# Altium project BTF16.PrjPcb
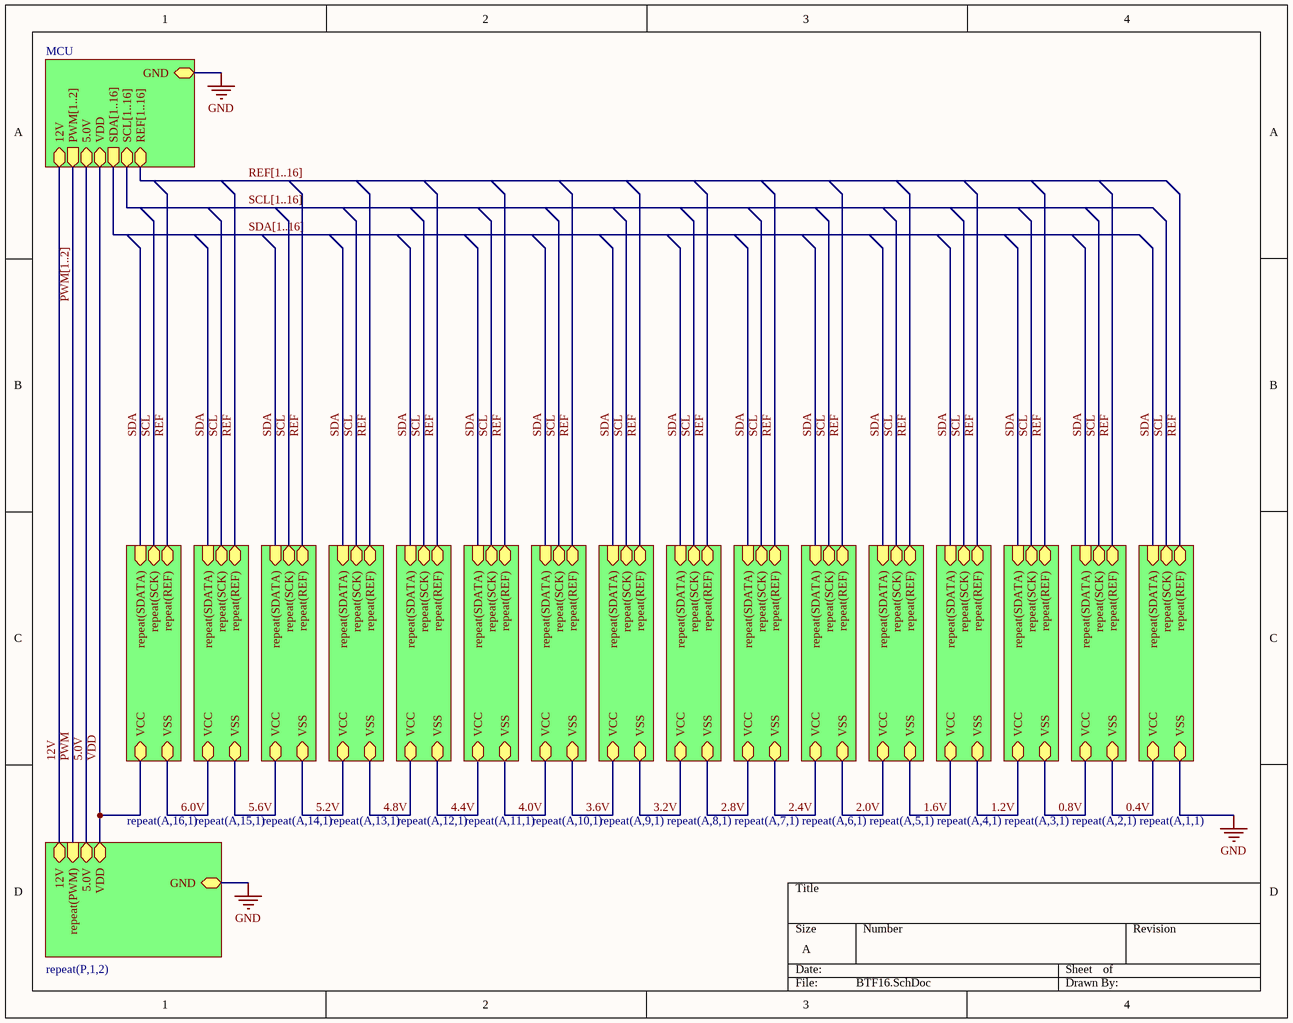
[diagram p0: BTF16.SchDoc]
4 sheets, 80 parts. Net scope: strictly hierarchical (ports join the sheet entries above them; power ports are local).
Board file: BTF16.PcbDoc
Sheets:
  BTF16.SchDoc
    MCU = MCU.SchDoc
    P1 = POWER.SchDoc
    P2 = POWER.SchDoc
    A1 = ASIC.SchDoc

## Sheet BTF16.SchDoc
size A

### Sub-sheets
MCU = MCU.SchDoc: VDD, GND, SDA[1..16] (out), SCL[1..16], 12V, REF[1..16], 5.0V, PWM[1..2] (out)
repeat(A,1,1) = ASIC.SchDoc: VCC, VSS, repeat(SDATA) (in), repeat(SCK), repeat(REF)
repeat(A,2,1) = ASIC.SchDoc: VCC, VSS, repeat(SDATA) (in), repeat(SCK), repeat(REF)
repeat(A,3,1) = ASIC.SchDoc: VCC, VSS, repeat(SDATA) (in), repeat(SCK), repeat(REF)
repeat(A,4,1) = ASIC.SchDoc: VCC, VSS, repeat(SDATA) (in), repeat(SCK), repeat(REF)
repeat(A,5,1) = ASIC.SchDoc: VCC, VSS, repeat(SDATA) (in), repeat(SCK), repeat(REF)
repeat(A,6,1) = ASIC.SchDoc: VCC, VSS, repeat(SDATA) (in), repeat(SCK), repeat(REF)
repeat(A,7,1) = ASIC.SchDoc: VCC, VSS, repeat(SDATA) (in), repeat(SCK), repeat(REF)
repeat(A,8,1) = ASIC.SchDoc: VCC, VSS, repeat(SDATA) (in), repeat(SCK), repeat(REF)
repeat(A,9,1) = ASIC.SchDoc: VCC, VSS, repeat(SDATA) (in), repeat(SCK), repeat(REF)
repeat(A,10,1) = ASIC.SchDoc: VCC, VSS, repeat(SDATA) (in), repeat(SCK), repeat(REF)
repeat(A,11,1) = ASIC.SchDoc: VCC, VSS, repeat(SDATA) (in), repeat(SCK), repeat(REF)
repeat(A,12,1) = ASIC.SchDoc: VCC, VSS, repeat(SDATA) (in), repeat(SCK), repeat(REF)
repeat(A,13,1) = ASIC.SchDoc: VCC, VSS, repeat(SDATA) (in), repeat(SCK), repeat(REF)
repeat(A,14,1) = ASIC.SchDoc: VCC, VSS, repeat(SDATA) (in), repeat(SCK), repeat(REF)
repeat(A,15,1) = ASIC.SchDoc: VCC, VSS, repeat(SDATA) (in), repeat(SCK), repeat(REF)
repeat(A,16,1) = ASIC.SchDoc: VCC, VSS, repeat(SDATA) (in), repeat(SCK), repeat(REF)
repeat(P,1,2) = POWER.SchDoc: GND, VDD, 12V, 5.0V, repeat(PWM) (in)

### Nets
GND: sheet MCU/GND, sheet repeat(P,1,2)/GND, sheet repeat(A,1,1)/VSS
0.4V: sheet repeat(A,1,1)/VCC, sheet repeat(A,2,1)/VSS
0.8V: sheet repeat(A,2,1)/VCC, sheet repeat(A,3,1)/VSS
1.2V: sheet repeat(A,4,1)/VSS, sheet repeat(A,3,1)/VCC
1.6V: sheet repeat(A,4,1)/VCC, sheet repeat(A,5,1)/VSS
2.0V: sheet repeat(A,5,1)/VCC, sheet repeat(A,6,1)/VSS
2.4V: sheet repeat(A,6,1)/VCC, sheet repeat(A,7,1)/VSS
2.8V: sheet repeat(A,7,1)/VCC, sheet repeat(A,8,1)/VSS
3.2V: sheet repeat(A,8,1)/VCC, sheet repeat(A,9,1)/VSS
3.6V: sheet repeat(A,9,1)/VCC, sheet repeat(A,10,1)/VSS
4.0V: sheet repeat(A,10,1)/VCC, sheet repeat(A,11,1)/VSS
4.4V: sheet repeat(A,12,1)/VSS, sheet repeat(A,11,1)/VCC
4.8V: sheet repeat(A,12,1)/VCC, sheet repeat(A,13,1)/VSS
5.0V: sheet MCU/5.0V, sheet repeat(P,1,2)/5.0V
5.2V: sheet repeat(A,13,1)/VCC, sheet repeat(A,14,1)/VSS
5.6V: sheet repeat(A,14,1)/VCC, sheet repeat(A,15,1)/VSS
6.0V: sheet repeat(A,15,1)/VCC, sheet repeat(A,16,1)/VSS
12V: sheet MCU/12V, sheet repeat(P,1,2)/12V
PWM: sheet repeat(P,1,2)/repeat(PWM)
REF: sheet repeat(A,1,1)/repeat(REF), sheet repeat(A,2,1)/repeat(REF), sheet repeat(A,4,1)/repeat(REF), sheet repeat(A,3,1)/repeat(REF), sheet repeat(A,5,1)/repeat(REF), sheet repeat(A,6,1)/repeat(REF), sheet repeat(A,7,1)/repeat(REF), sheet repeat(A,8,1)/repeat(REF), sheet repeat(A,9,1)/repeat(REF), sheet repeat(A,10,1)/repeat(REF), sheet repeat(A,12,1)/repeat(REF), sheet repeat(A,13,1)/repeat(REF), sheet repeat(A,14,1)/repeat(REF), sheet repeat(A,15,1)/repeat(REF), sheet repeat(A,16,1)/repeat(REF), sheet repeat(A,11,1)/repeat(REF)
SCL: sheet repeat(A,1,1)/repeat(SCK), sheet repeat(A,2,1)/repeat(SCK), sheet repeat(A,4,1)/repeat(SCK), sheet repeat(A,3,1)/repeat(SCK), sheet repeat(A,5,1)/repeat(SCK), sheet repeat(A,6,1)/repeat(SCK), sheet repeat(A,7,1)/repeat(SCK), sheet repeat(A,8,1)/repeat(SCK), sheet repeat(A,9,1)/repeat(SCK), sheet repeat(A,10,1)/repeat(SCK), sheet repeat(A,12,1)/repeat(SCK), sheet repeat(A,13,1)/repeat(SCK), sheet repeat(A,14,1)/repeat(SCK), sheet repeat(A,15,1)/repeat(SCK), sheet repeat(A,16,1)/repeat(SCK), sheet repeat(A,11,1)/repeat(SCK)
SDA: sheet repeat(A,1,1)/repeat(SDATA), sheet repeat(A,2,1)/repeat(SDATA), sheet repeat(A,4,1)/repeat(SDATA), sheet repeat(A,3,1)/repeat(SDATA), sheet repeat(A,5,1)/repeat(SDATA), sheet repeat(A,6,1)/repeat(SDATA), sheet repeat(A,7,1)/repeat(SDATA), sheet repeat(A,8,1)/repeat(SDATA), sheet repeat(A,9,1)/repeat(SDATA), sheet repeat(A,10,1)/repeat(SDATA), sheet repeat(A,12,1)/repeat(SDATA), sheet repeat(A,13,1)/repeat(SDATA), sheet repeat(A,14,1)/repeat(SDATA), sheet repeat(A,15,1)/repeat(SDATA), sheet repeat(A,16,1)/repeat(SDATA), sheet repeat(A,11,1)/repeat(SDATA)
VDD: sheet MCU/VDD, sheet repeat(P,1,2)/VDD, sheet repeat(A,16,1)/VCC

### Buses and harness runs
bus PWM[1..2] = sheet MCU/PWM[1..2]
bus REF[1..16] = sheet MCU/REF[1..16]
bus SCL[1..16] = sheet MCU/SCL[1..16]
bus SDA[1..16] = sheet MCU/SDA[1..16]

## Sheet MCU.SchDoc
size A
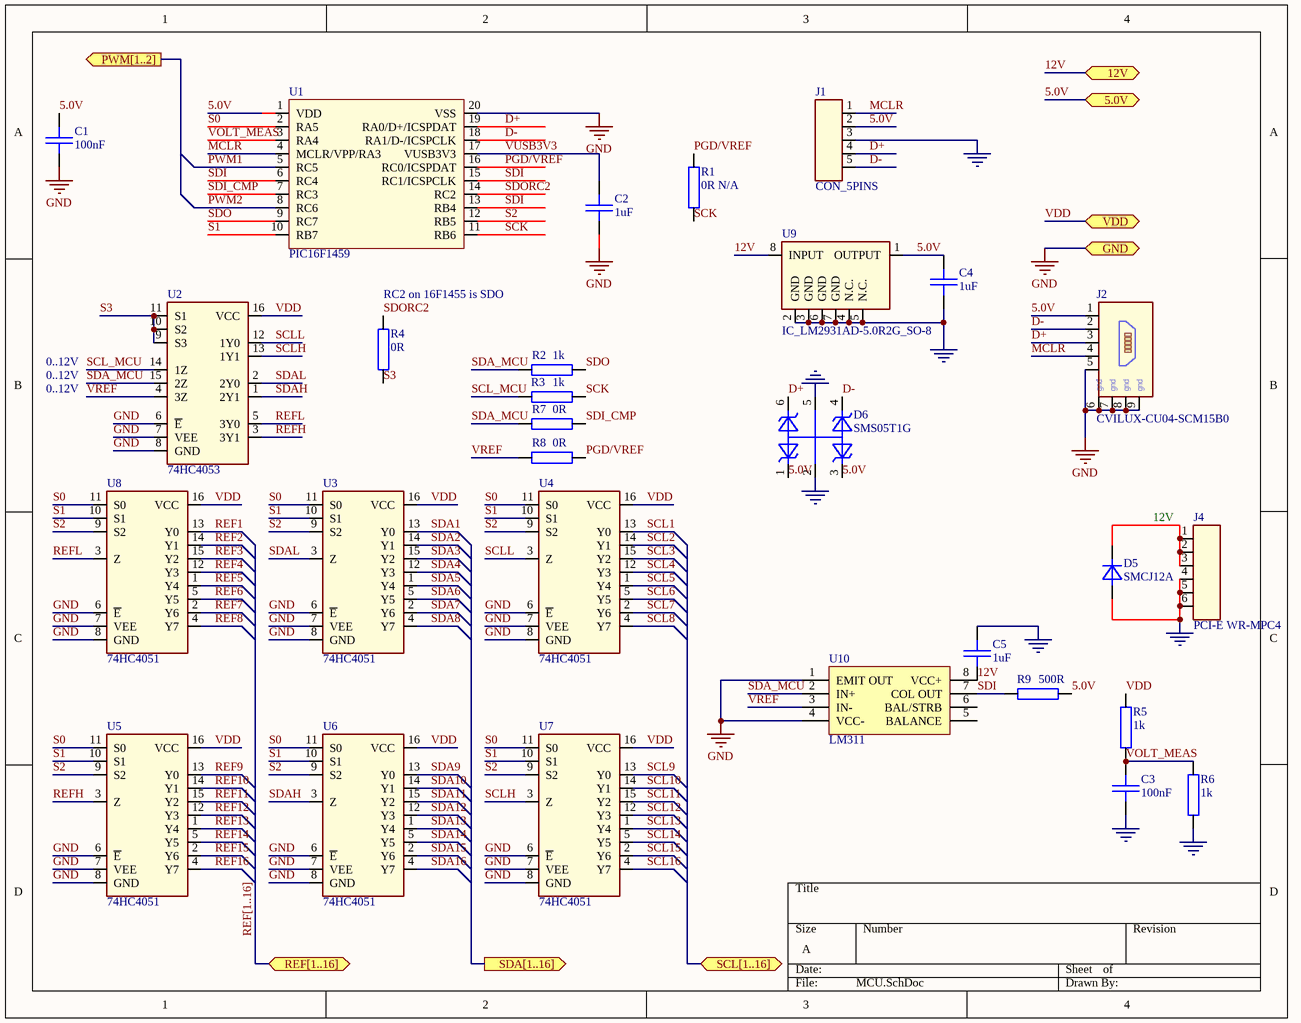
[diagram p1: MCU.SchDoc]

### Parts
(Parts that share a designator on the sheet are numbered #1, #2 ... from top to bottom, then left to right.)
C1#1  100nF  [SMD_0603_CAPC1608X95N]
C2#1  1uF  [SMD_0603_CAPC1608X95N]
C3#1  100nF  [SMD_0603_CAPC1608X95N]
C4#1  1uF  [SMD_0603_CAPC1608X95N]
C5#1  1uF  [SMD_0603_CAPC1608X95N]
D5  SMCJ12A  [SMD_DO214AC_SMC]
D6  SMS05T1G  [SMD_SOT95P280X145-6N]
J1  CON_5PINS  [SIP5 - PGM]
J2  CVILUX-CU04-SCM15B0  [SMD_CON-CVILUX-CU04-SCM15B0]
J4  PCI-E WR-MPC4  [PTH_CON_WR-MRC4-6P_S]
R1#1  0R N/A  [SMD_0603_RESC1608X55N]
R2#1  1k  [SMD_0603_RESC1608X55N]
R3  1k  [SMD_0603_RESC1608X55N]
R4  0R  [SMD_0603_RESC1608X55N]
R5  1k  [SMD_0603_RESC1608X55N]
R6  1k  [SMD_0603_RESC1608X55N]
R7  0R  [SMD_0603_RESC1608X55N]
R8  0R  [SMD_0603_RESC1608X55N]
R9  500R  [SMD_0603_RESC1608X55N]
U1#1  PIC16F1459  [SMD_SOP65P640X110-20N]
U2  74HC4053  [SMD_SOIC127P600X175-16N]
U3  74HC4051  [SMD_SOIC127P600X175-16N]
U4  74HC4051  [SMD_SOIC127P600X175-16N]
U5  74HC4051  [SMD_SOIC127P600X175-16N]
U6  74HC4051  [SMD_SOIC127P600X175-16N]
U7  74HC4051  [SMD_SOIC127P600X175-16N]
U8  74HC4051  [SMD_SOIC127P600X175-16N]
U9  IC_LM2931AD-5.0R2G_SO-8  [SMD_SOIC127P600X175-8N]
U10  LM311  [SMD_SOIC127P600X175-8N]

### Ports
5.0V, 12V, GND, PWM[1..2] (out), REF[1..16], SCL[1..16], SDA[1..16] (out), VDD

### Nets
GND: C1#1.2 C2#1.2 C3#1.2 C4#1.2 C5#1.1 D5.2(A) D6.2(AAAA) D6.5(C4) J1.3 J2.5 J2.6 J2.7 J2.8 J2.9 J4.4 J4.5 J4.6 R6.2 U1#1.20(VSS) U2.6(~{E}) U2.7(VEE) U2.8(GND) U3.6(~{E}) U3.7(VEE) U3.8(GND) U4.6(~{E}) U4.7(VEE) U4.8(GND) U5.6(~{E}) U5.7(VEE) U5.8(GND) U6.6(~{E}) U6.7(VEE) U6.8(GND) U7.6(~{E}) U7.7(VEE) U7.8(GND) U8.6(~{E}) U8.7(VEE) U8.8(GND) U9.2(GND) U9.3(GND) U9.4(N.C.) U9.5(N.C.) U9.6(GND) U9.7(GND) U10.1(EMIT_OUT) U10.4(VCC-) ; port GND
5.0V: C1#1.1 C4#1.1 D6.1(C1) D6.3(C2) J1.2 J2.1 R9.2 U1#1.1(VDD) U9.1(OUTPUT) ; port 5.0V
12V: C5#1.2 D5.1(C) J4.1 J4.2 J4.3 U9.8(INPUT) U10.8(VCC+) ; port 12V
D+: D6.6(C4) J1.4 J2.3 U1#1.19(RA0/D+/ICSPDAT)
D-: D6.4(C3) J1.5 J2.2 U1#1.18(RA1/D-/ICSPCLK)
MCLR: J1.1 J2.4 U1#1.4(MCLR/VPP/RA3)
PGD/VREF: R1#1.1 R8.1 U1#1.16(RC0/ICSPDAT)
PWM1: U1#1.5(RC5)
PWM2: U1#1.8(RC6)
REF1: U8.13(Y0)
REF2: U8.14(Y1)
REF3: U8.15(Y2)
REF4: U8.12(Y3)
REF5: U8.1(Y4)
REF6: U8.5(Y5)
REF7: U8.2(Y6)
REF8: U8.4(Y7)
REF9: U5.13(Y0)
REF10: U5.14(Y1)
REF11: U5.15(Y2)
REF12: U5.12(Y3)
REF13: U5.1(Y4)
REF14: U5.5(Y5)
REF15: U5.2(Y6)
REF16: U5.4(Y7)
REFH: U2.3(3Y1) U5.3(Z)
REFL: U2.5(3Y0) U8.3(Z)
S0: U1#1.2(RA5) U3.11(S0) U4.11(S0) U5.11(S0) U6.11(S0) U7.11(S0) U8.11(S0)
S1: U1#1.10(RB7) U3.10(S1) U4.10(S1) U5.10(S1) U6.10(S1) U7.10(S1) U8.10(S1)
S2: U1#1.12(RB5) U3.9(S2) U4.9(S2) U5.9(S2) U6.9(S2) U7.9(S2) U8.9(S2)
S3: R4.1 U2.9(S3) U2.10(S2) U2.11(S1)
SCK: R1#1.2 R3.2 U1#1.11(RB6)
SCL1: U4.13(Y0)
SCL2: U4.14(Y1)
SCL3: U4.15(Y2)
SCL4: U4.12(Y3)
SCL5: U4.1(Y4)
SCL6: U4.5(Y5)
SCL7: U4.2(Y6)
SCL8: U4.4(Y7)
SCL9: U7.13(Y0)
SCL10: U7.14(Y1)
SCL11: U7.15(Y2)
SCL12: U7.12(Y3)
SCL13: U7.1(Y4)
SCL14: U7.5(Y5)
SCL15: U7.2(Y6)
SCL16: U7.4(Y7)
SCL_MCU: R3.1 U2.14(1Z)
SCLH: U2.13(1Y1) U7.3(Z)
SCLL: U2.12(1Y0) U4.3(Z)
SDA1: U3.13(Y0)
SDA2: U3.14(Y1)
SDA3: U3.15(Y2)
SDA4: U3.12(Y3)
SDA5: U3.1(Y4)
SDA6: U3.5(Y5)
SDA7: U3.2(Y6)
SDA8: U3.4(Y7)
SDA9: U6.13(Y0)
SDA10: U6.14(Y1)
SDA11: U6.15(Y2)
SDA12: U6.12(Y3)
SDA13: U6.1(Y4)
SDA14: U6.5(Y5)
SDA15: U6.2(Y6)
SDA16: U6.4(Y7)
SDA_MCU: R2#1.2 R7.2 U2.15(2Z) U10.2(IN+)
SDAH: U2.1(2Y1) U6.3(Z)
SDAL: U2.2(2Y0) U3.3(Z)
SDI: R9.1 U1#1.6(RC4) U1#1.13(RB4) U1#1.15(RC1/ICSPCLK) U10.7(COL_OUT)
SDI_CMP: R7.1 U1#1.7(RC3)
SDO: R2#1.1 U1#1.9(RC7)
SDORC2: R4.2 U1#1.14(RC2)
VDD: R5.1 U2.16(VCC) U3.16(VCC) U4.16(VCC) U5.16(VCC) U6.16(VCC) U7.16(VCC) U8.16(VCC) ; port VDD
VOLT_MEAS: C3#1.1 R5.2 R6.1 U1#1.3(RA4)
VREF: R8.2 U2.4(3Z) U10.3(IN-)
VUSB3V3: C2#1.1 U1#1.17(VUSB3V3)

Not connected (* = marked no-connect by the designer): U10 5(BALANCE) 6(BAL/STRB)

### Buses and harness runs
bus REF[1..16] = port REF[1..16]

### Notes on the sheet
- (near R4) RC2 on 16F1455 is SDO
- 0..12V
- (in symbol CON_USB_MINI) gnd

### Library data of the parts
C1#1 C2#1 C3#1 C4#1 C5#1 = C: NOTE: <NOTE>
D5 = D: NOTE: <NOTE>
D6 = D_TVS_QUAD_C1AA2AA5C3C4C6: 4 IO lines TVS; NOTE: <NOTE>
J1 = CON_5PINS: NOTE: <NOTE>
J2 = CON_USB_MINI: NOTE: <NOTE>
J4 = CON_6PINS: NOTE: <NOTE>
R1#1 R2#1 R3-R9 = R: NOTE: <NOTE>; R_BDS: R
U1#1 = IC_PIC16F1459
U2 = IC_74HC4053: Triple 2-channel analog multiplexer/demultiplexer
U3-U8 = IC_74HC4051: 8-channel analog multiplexer/demultiplexer
U10 = IC_LM311: Comparator

## Sheet POWER.SchDoc
size A
Used 2 times, as channels P1, P2. Parts and nets are listed once, with the designators drawn on the sheet.
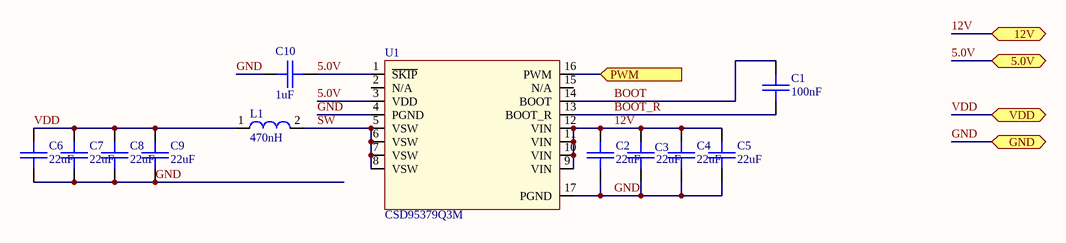
[diagram p2: POWER.SchDoc]

### Parts
C1  100nF  [SMD_0603_CAPC1608X95N]
C2  22uF  [SMD_0805_CAPC2012X95N]
C3  22uF  [SMD_0805_CAPC2012X95N]
C4  22uF  [SMD_0805_CAPC2012X95N]
C5  22uF  [SMD_0805_CAPC2012X95N]
C6  22uF  [SMD_0805_CAPC2012X95N]
C7  22uF  [SMD_0805_CAPC2012X95N]
C8  22uF  [SMD_0805_CAPC2012X95N]
C9  22uF  [SMD_0805_CAPC2012X95N]
C10  1uF  [SMD_0603_CAPC1608X95N]
L1  470nH  [SMD_INDM720X665X300]
U1  CSD95379Q3M  [SMD_SON50P340X340X80-21N - VSON10]

### Ports
5.0V, 12V, GND, PWM (in), VDD

### Nets
5.0V: C10.1 U1.1(~{SKIP}) U1.3(VDD) ; port 5.0V
12V: C2.1 C3.1 C4.1 C5.1 U1.9(VIN) U1.10(VIN) U1.11(VIN) U1.12(VIN) ; port 12V
BOOT: C1.1 U1.14(BOOT)
BOOT_R: C1.2 U1.13(BOOT_R)
GND: C2.2 C3.2 C4.2 C5.2 C6.2 C7.2 C8.2 C9.2 C10.2 U1.4(PGND) U1.17(PGND) ; port GND
PWM: U1.16(PWM) ; port PWM
SW: L1.2 U1.5(VSW) U1.6(VSW) U1.7(VSW) U1.8(VSW)
VDD: C6.1 C7.1 C8.1 C9.1 L1.1 ; port VDD

Not connected (* = marked no-connect by the designer): U1 2(N/A) 15(N/A)

### Channels
P1: designators C1=P1C1 C2=P1C2 C3=P1C3 C4=P1C4 C5=P1C5 C6=P1C6 C7=P1C7 C8=P1C8 C9=P1C9 C10=P1C10 L1=P1L1 U1=P1U1; ports 5.0V=5.0V 12V=12V GND=GND PWM=PWM1 VDD=VDD
P2: designators C1=P2C1 C2=P2C2 C3=P2C3 C4=P2C4 C5=P2C5 C6=P2C6 C7=P2C7 C8=P2C8 C9=P2C9 C10=P2C10 L1=P2L1 U1=P2U1; ports 5.0V=5.0V 12V=12V GND=GND PWM=PWM2 VDD=VDD

### Library data of the parts
C1-C10 = C: NOTE: <NOTE>
L1 = L
U1 = IC_CSD95379Q3M: Texas Instrumendts Buck Boost DC-DC

## Sheet ASIC.SchDoc
size A
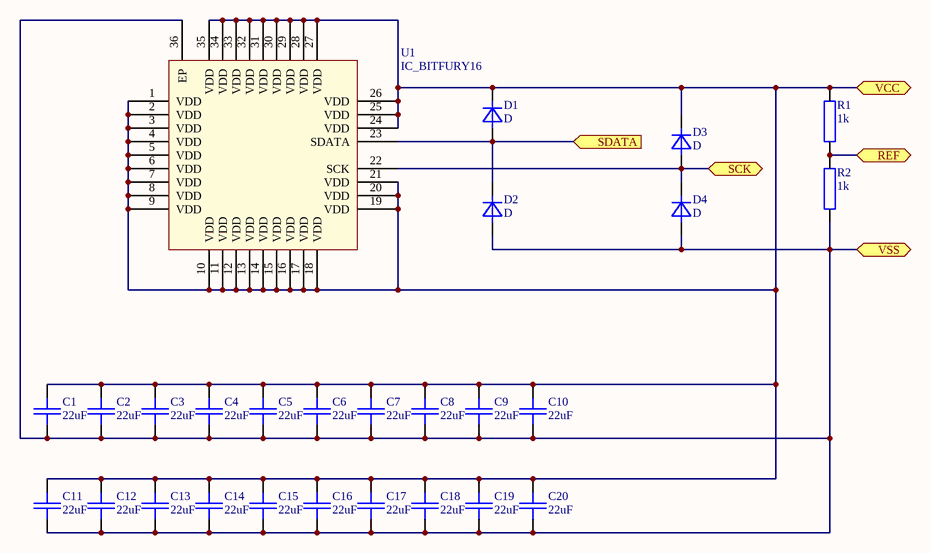
[diagram p3: ASIC.SchDoc]

### Parts
(Parts that share a designator on the sheet are numbered #1, #2 ... from top to bottom, then left to right.)
C1#2  22uF  [SMD_0805_CAPC2012X95N]
C2#2  22uF  [SMD_0805_CAPC2012X95N]
C3#2  22uF  [SMD_0805_CAPC2012X95N]
C4#2  22uF  [SMD_0805_CAPC2012X95N]
C5#2  22uF  [SMD_0805_CAPC2012X95N]
C6  22uF  [SMD_0805_CAPC2012X95N]
C7  22uF  [SMD_0805_CAPC2012X95N]
C8  22uF  [SMD_0805_CAPC2012X95N]
C9  22uF  [SMD_0805_CAPC2012X95N]
C10  22uF  [SMD_0805_CAPC2012X95N]
C11  22uF  [SMD_0805_CAPC2012X95N]
C12  22uF  [SMD_0805_CAPC2012X95N]
C13  22uF  [SMD_0805_CAPC2012X95N]
C14  22uF  [SMD_0805_CAPC2012X95N]
C15  22uF  [SMD_0805_CAPC2012X95N]
C16  22uF  [SMD_0805_CAPC2012X95N]
C17  22uF  [SMD_0805_CAPC2012X95N]
C18  22uF  [SMD_0805_CAPC2012X95N]
C19  22uF  [SMD_0805_CAPC2012X95N]
C20  22uF  [SMD_0805_CAPC2012X95N]
D1  D  [SMD_SOD523_SOD1608X65N]
D2  D  [SMD_SOD523_SOD1608X65N]
D3  D  [SMD_SOD523_SOD1608X65N]
D4  D  [SMD_SOD523_SOD1608X65N]
R1#2  1k  [SMD_0603_RESC1608X55N]
R2#2  1k  [SMD_0603_RESC1608X55N]
U1#2  IC_BITFURY16  [SMD_QFN65P600X600X100-36AN]

### Ports
REF, SCK, SDATA (in), VCC, VSS

### Nets
GND: C1#2.2 C2#2.2 C3#2.2 C4#2.2 C5#2.2 C6.2 C7.2 C8.2 C9.2 C10.2 C11.2 C12.2 C13.2 C14.2 C15.2 C16.2 C17.2 C18.2 C19.2 C20.2 D2.2(A) D4.2(A) R2#2.2 U1#2.36(EP) ; port VSS
0.4V: C1#2.1 C2#2.1 C3#2.1 C4#2.1 C5#2.1 C6.1 C7.1 C8.1 C9.1 C10.1 C11.1 C12.1 C13.1 C14.1 C15.1 C16.1 C17.1 C18.1 C19.1 C20.1 D1.1(C) D3.1(C) R1#2.1 U1#2.1(VDD) U1#2.2(VDD) U1#2.3(VDD) U1#2.4(VDD) U1#2.5(VDD) U1#2.6(VDD) U1#2.7(VDD) U1#2.8(VDD) U1#2.9(VDD) U1#2.10(VDD) U1#2.11(VDD) U1#2.12(VDD) U1#2.13(VDD) U1#2.14(VDD) U1#2.15(VDD) U1#2.16(VDD) U1#2.17(VDD) U1#2.18(VDD) U1#2.19(VDD) U1#2.20(VDD) U1#2.21(VDD) U1#2.24(VDD) U1#2.25(VDD) U1#2.26(VDD) U1#2.27(VDD) U1#2.28(VDD) U1#2.29(VDD) U1#2.30(VDD) U1#2.31(VDD) U1#2.32(VDD) U1#2.33(VDD) U1#2.34(VDD) U1#2.35(VDD) ; port VCC
REF1: R1#2.2 R2#2.1 ; port REF
SCL1: D3.2(A) D4.1(C) U1#2.22(SCK) ; port SCK
SDA1: D1.2(A) D2.1(C) U1#2.23(SDATA) ; port SDATA

### Library data of the parts
C1#2 C2#2 C3#2 C4#2 C5#2 C6-C20 = C: NOTE: <NOTE>
D1-D4 = D: NOTE: <NOTE>
R1#2 R2#2 = R: NOTE: <NOTE>; R_BDS: R
U1#2 = IC_BITFURY16: BitFury 2016 16 nm

## Nets that join several sheets
GND: MCU (48 pins), P1 (11 pins), P2 (11 pins), ASIC (24 pins)
5.0V: MCU (9 pins), P1 (P1C10.1 P1U1.1 P1U1.3), P2 (P2C10.1 P2U1.1 P2U1.3)
12V: MCU (7 pins), P1 (8 pins), P2 (8 pins)
REF1: MCU (U8.13), ASIC (R1#2.2 R2#2.1)
VDD: MCU (8 pins), P1 (5 pins), P2 (5 pins)